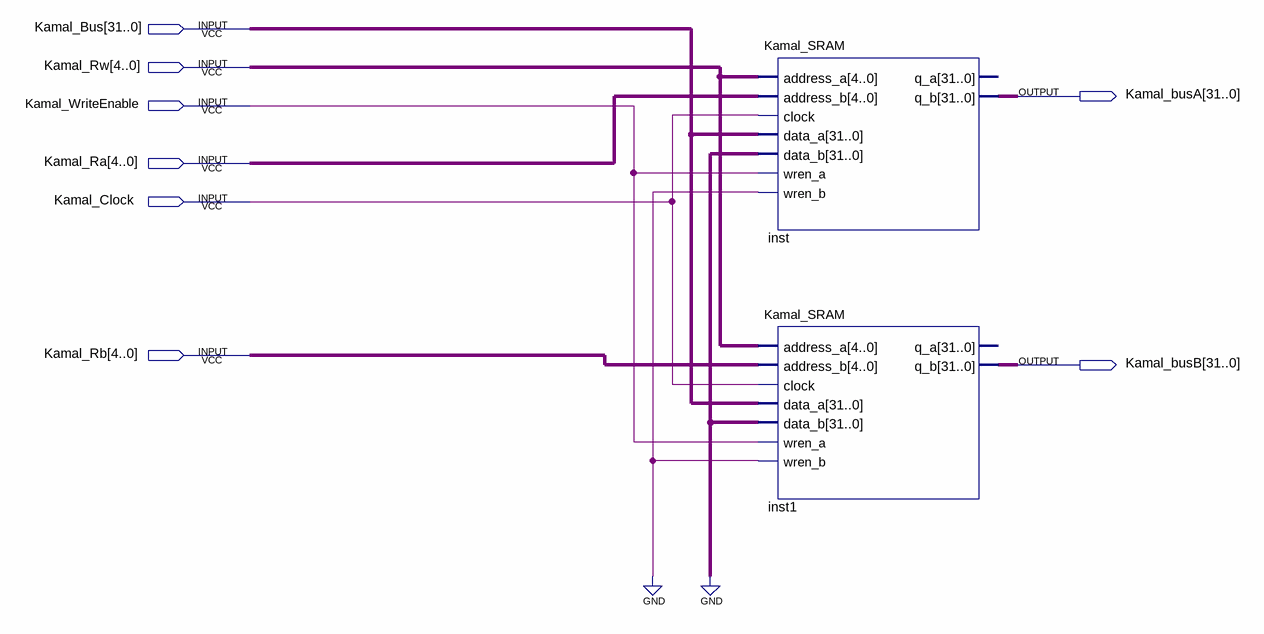
[diagram p0: schematic sheet]
// Quartus schematic Kamal_RegisterFile.bdf as structural Verilog: 2 symbols, 8 pins
module Kamal_RegisterFile (
  input  [31:0] Kamal_Bus,
  input  [4:0] Kamal_Rw,
  input  Kamal_WriteEnable,
  input  [4:0] Kamal_Ra,
  input  Kamal_Clock,
  input  [4:0] Kamal_Rb,
  output [31:0] Kamal_busA,
  output [31:0] Kamal_busB
);

  Kamal_SRAM inst (
    .address_a(Kamal_Rw), .address_b(Kamal_Ra), .clock(Kamal_Clock), .data_a(Kamal_Bus), .data_b({32{1'b0}}),
    .wren_a(Kamal_WriteEnable), .wren_b(1'b0), .q_b(Kamal_busA));  // open: q_a
  Kamal_SRAM inst1 (
    .address_a(Kamal_Rw), .address_b(Kamal_Rb), .clock(Kamal_Clock), .data_a(Kamal_Bus), .data_b({32{1'b0}}),
    .wren_a(Kamal_WriteEnable), .wren_b(1'b0), .q_b(Kamal_busB));  // open: q_a
endmodule
